# Altium schematic sheet AGC电路.SchDoc
size A0
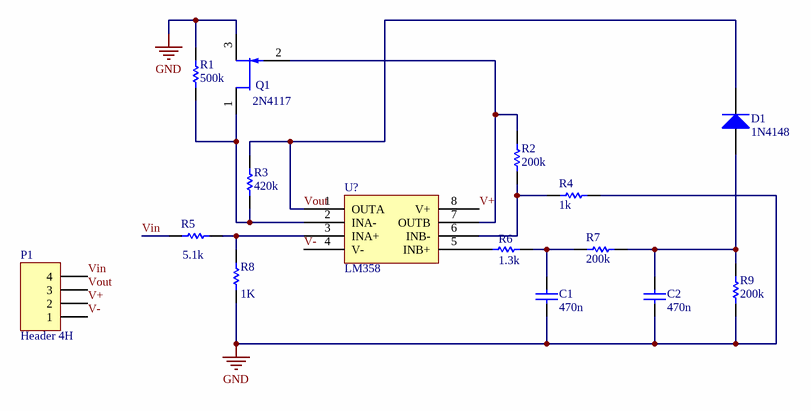
[diagram p0: AGC电路.SchDoc]

## Parts
C1  470n  [0805CAP]
C2  470n  [0805CAP]
D1  1N4148  [SMC]
P1  Header 4H  [HDR1X4]
Q1  2N4117  [TO-226-AA]
R1  500k  [0805]
R2  200k  [0805]
R3  420k  [0805]
R4  1k  [0805]
R5  value 5.1k  [0805]
R6  1.3k  [0805]
R7  200k  [0805]
R8  value 1K  [0805]
R9  200k  [0805]
U?  LM358  [DIP08]

## Nets
GND: C1.1 C2.1 Q1.3(S) R1.2 R4.2 R8.1 R9.1
V+: P1.2 U?.8(V+)
V-: P1.1 U?.4(V-)
Vin: P1.4 R5.1
Vout: D1.2(K) P1.3 R3.2 U?.1(OUTA)
NetC1_2: C1.2 R6.2 R7.1
NetC2_2: C2.2 D1.1(A) R7.2 R9.2
NetQ1_1: Q1.1(D) R1.1 R3.1 U?.2(INA-)
NetQ1_2: Q1.2(G) R2.2 U?.7(OUTB)
NetR2_1: R2.1 R4.1 U?.6(INB-)
NetR5_2: R5.2 R8.2 U?.3(INA+)
NetR6_1: R6.1 U?.5(INB+)

## Library data of the parts
C1 C2 = Cap: Capacitor; Published: 8-Jun-2000; LatestRevisionDate: 17-Jul-2002; LatestRevisionNote: Re-released for DXP Platform.; PackageReference: RAD-0.3; Publisher: Altium Limited; PackageDescription: Radial Cap, Thru-Hole; 2 Leads; 0.3 in Pin Spacing
D1 = Diode 1N4001: 1 Amp General Purpose Rectifier; Published: 8-Jun-2000; LatestRevisionDate: 17-Jul-2002; LatestRevisionNote: Re-released for DXP Platform.; DatasheetVersion: 1998; PackageVersion: Aug-1999; PackageReference: DO-41; Publisher: Altium Limited; PackageDescription: Diode, Axial; Body 5.2 x 2.7 mm (LxDia. max), Lead Dia. 0.86 mm (max); Code_JEDEC: DO-204-AL; ComponentLink1Description: Manufacturer Link; ComponentLink1URL: http://www.fairchildsemi.com/; ComponentLink2Description: Datasheet; ComponentLink2URL: http://www.fairchildsemi.com/ds/1N%2F1N4001.pdf
P1 = Header 4H: Header, 4-Pin, Right Angle; LatestRevisionDate: 17-Jul-2002; LatestRevisionNote: Re-released for DXP Platform.; Publisher: Altium Limited
Q1 = JFET-N: N-Channel JFET; Published: 8-Jun-2000; LatestRevisionDate: 17-Jul-2002; LatestRevisionNote: Re-released for DXP Platform.; PackageReference: TO-254-AA; Publisher: Altium Limited; Code_JEDEC: TO-254-AA
R1-R9 = Res1: Resistor; Published: 8-Jun-2000; LatestRevisionDate: 17-Jul-2002; LatestRevisionNote: Re-released for DXP Platform.; PackageReference: AXIAL-0.3; Publisher: Altium Limited; PackageDescription: Axial Device, Thru-Hole; 2 Leads; 0.3 in Pin Spacing